# EAGLE design NRF24_4 (EAGLE 6.5.0)
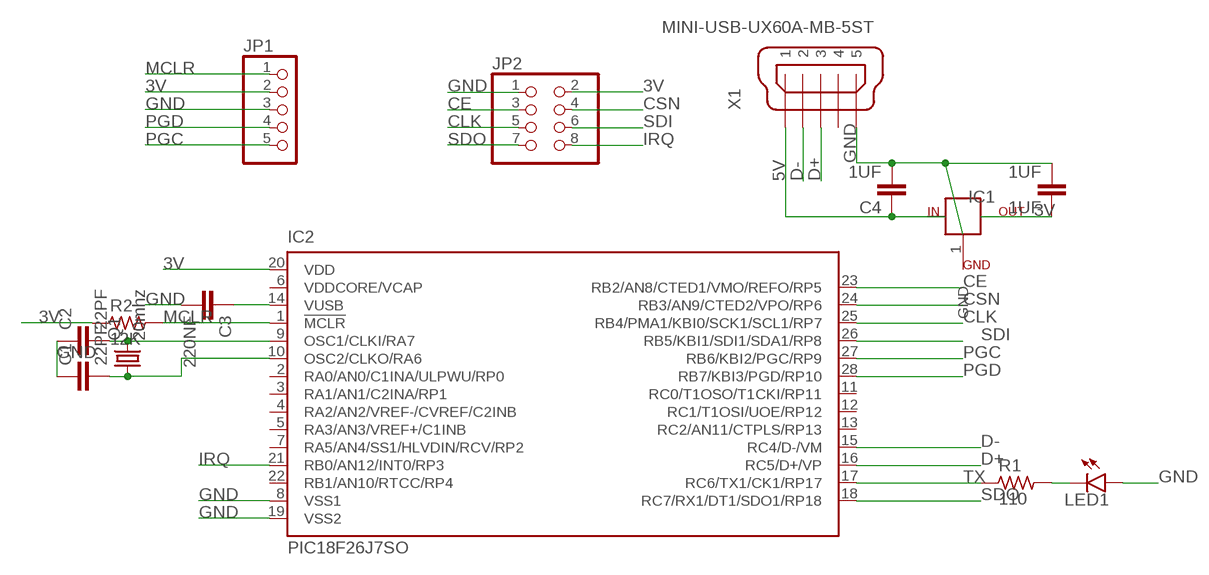
[diagram p0: schematic, sheet 1]

## Parts
1UF  1UF  C-EU025-024X044  [C025-024X044]
C1  22PF  C-EUC0805K  [C0805K]
C2  22PF  C-EUC0805K  [C0805K]
C3  220NF  C-EUC0805K  [C0805K]
C4  1UF  C-EU025-024X044  [C025-024X044]
IC1  MCP17  ZENER-DIODESOT223  [SOT223]
IC2  PIC18F26J7SO  [SO28W]
JP1  PINHD-1X5  [1X05]
JP2  PINHD-2X4  [2X04]
LED1  LED3MM  [LED3MM]
Q1  20mhz  CRYTALHC49S  [HC49/S]
R1  110  R_0805  [R0805]
R2  12K  R_0805  [R0805]
X1  MINI-USB-UX60A-MB-5ST  [UX60A-MB-5ST]

## Nets
3V: 1UF.1 IC1.3(OUT) IC2.20(VDD) JP1.2 JP2.2 R2.1
5V: C4.1 IC1.2(IN) X1.1
CE: IC2.23(RB2/AN8/CTED1/VMO/REFO/RP5) JP2.3
CLK: IC2.25(RB4/PMA1/KBI0/SCK1/SCL1/RP7) JP2.5
CSN: IC2.24(RB3/AN9/CTED2/VPO/RP6) JP2.4
D+: IC2.16(RC5/D+/VP) X1.3
D-: IC2.15(RC4/D-/VM) X1.2
GND: 1UF.2 C1.1 C2.1 C3.2 C4.2 IC1.1(GND) IC2.8(VSS1) IC2.19(VSS2) JP1.3 JP2.1 LED1.A(ANODE) X1.5
IRQ: IC2.21(RB0/AN12/INT0/RP3) JP2.8
MCLR: IC2.1(!MCLR) JP1.1 R2.2
N$4: C1.2 IC2.10(OSC2/CLKO/RA6) Q1.1
N$5: C2.2 IC2.9(OSC1/CLKI/RA7) Q1.2
N$6: C3.1 IC2.14(VUSB)
N$7: LED1.K(CATHODE) R1.2
PGC: IC2.27(RB6/KBI2/PGC/RP9) JP1.5
PGD: IC2.28(RB7/KBI3/PGD/RP10) JP1.4
SDI: IC2.26(RB5/KBI1/SDI1/SDA1/RP8) JP2.6
SDO: IC2.18(RC7/RX1/DT1/SDO1/RP18) JP2.7
TX: IC2.17(RC6/TX1/CK1/RP17) R1.1
Unconnected: IC2.2(RA0/AN0/C1INA/ULPWU/RP0) IC2.3(RA1/AN1/C2INA/RP1) IC2.4(RA2/AN2/VREF-/CVREF/C2INB) IC2.5(RA3/AN3/VREF+/C1INB) IC2.6(VDDCORE/VCAP) IC2.7(RA5/AN4/SS1/HLVDIN/RCV/RP2) IC2.11(RC0/T1OSO/T1CKI/RP11) IC2.12(RC1/T1OSI/UOE/RP12) IC2.13(RC2/AN11/CTPLS/RP13) IC2.22(RB1/AN10/RTCC/RP4) X1.4

## Library data of the parts
1UF C4 = qfm-trx1-24g:C-EU: CAPACITOR, European symbol
C1-C3 = rcl 2:C-EU: CAPACITOR, European symbol
IC1 = diode 2:ZENER-DIODE: Z-Diode
IC2 = microchip-dspic:PIC18F26J*: PIC18F47J53 Family High-Performance USB Microcontrollers with nanoWatt XLP Technology Source: Data sheet <http://ww1.microchip.com/downloads/en/DeviceDoc/39964B.pdf>; MPN: PIC18F27J53-I/SO; OC_FARNELL: unknown; OC_NEWARK: 63R7838
JP1 = pinhead 2:PINHD-1X5: PIN HEADER
JP2 = pinhead 2:PINHD-2X4: PIN HEADER
LED1 = tango:LED: LED OSRAM: - CHIPLED LG R971, LG N971, LY N971, LG Q971, LY Q971, LO R971, LY R971 LH N974, LH R974 LS Q976, LO Q976, LY Q976 LO Q996 - Hyper CHIPLED LW Q18S LB Q993, LB Q99A, LB R99A - SideLED LS A670, LO A670, LY A670, LG A670, LP A670 LB A673, LV A673, LT A673, LW A673 LH A674 LY A675 LS A676, LA A676, LO A676, LY A676, LW A676 LS A679, LY A679, LG A679 - Hyper Micro SIDELED® LS Y876, LA Y876, LO Y876, LY Y876 LT Y87S - SmartLED LW L88C, LW L88S LB L89C, LB L89S, LG L890 LS L89K, LO L89K, LY L89K LS L896, LA L896, LO L896, LY L896 - TOPLED LS T670, LO T670, LY T670, LG T670, LP T670 LSG T670, LSP T670, LSY T670, LOP T670, LYG T670 LG T671, LOG T671, LSG T671 LB T673, LV T673, LT T673, LW T673 LH T674 LS T676, LA T676, LO T676, LY T676, LB T676, LH T676, LSB T676, LW T676 LB T67C, LV T67C, LT T67C, LS T67K, LO T67K, LY T67K, LW E67C LS E67B, LA E67B, LO E67B, LY E67B, LB E67C, LV E67C, LT E67C LW T67C LS T679, LY T679, LG T679 LS T770, LO T770, LY T770, LG T770, LP T770 LB T773, LV T773, LT T773, LW T773 LH T774 LS E675, LA E675, LY E675, LS T675 LS T776, LA T776, LO T776, LY T776, LB T776 LHGB T686 LT T68C, LB T68C - Hyper Mini TOPLED® LB M676 - Mini TOPLED Santana® LG M470 LS M47K, LO M47K, LY M47K Source: http://www.osram.convergy.de - LUMILED® LXK2-PW12-R00, LXK2-PW12-S00, LXK2-PW14-U00, LXK2-PW14-V00 LXK2-PM12-R00, LXK2-PM12-S00, LXK2-PM14-U00 LXK2-PE12-Q00, LXK2-PE12-R00, LXK2-PE12-S00, LXK2-PE14-T00, LXK2-PE14-U00 LXK2-PB12-K00, LXK2-PB12-L00, LXK2-PB12-M00, LXK2-PB14-N00, LXK2-PB14-P00, LXK2-PB14-Q00 LXK2-PR12-L00, LXK2-PR12-M00, LXK2-PR14-Q00, LXK2-PR14-R00 LXK2-PD12-Q00, LXK2-PD12-R00, LXK2-PD12-S00 LXK2-PH12-R00, LXK2-PH12-S00 LXK2-PL12-P00, LXK2-PL12-Q00, LXK2-PL12-R00 Source: www.luxeon.com
Q1 = crystal 2:CRYTAL: CRYSTAL
R1 R2 = rc-master:R_: RESISTOR
X1 = con-hirose 2:MINI-USB-: MINI USB Connector Source: http://www.hirose.co.jp/cataloge_hp/e24000019.pdf

## Board
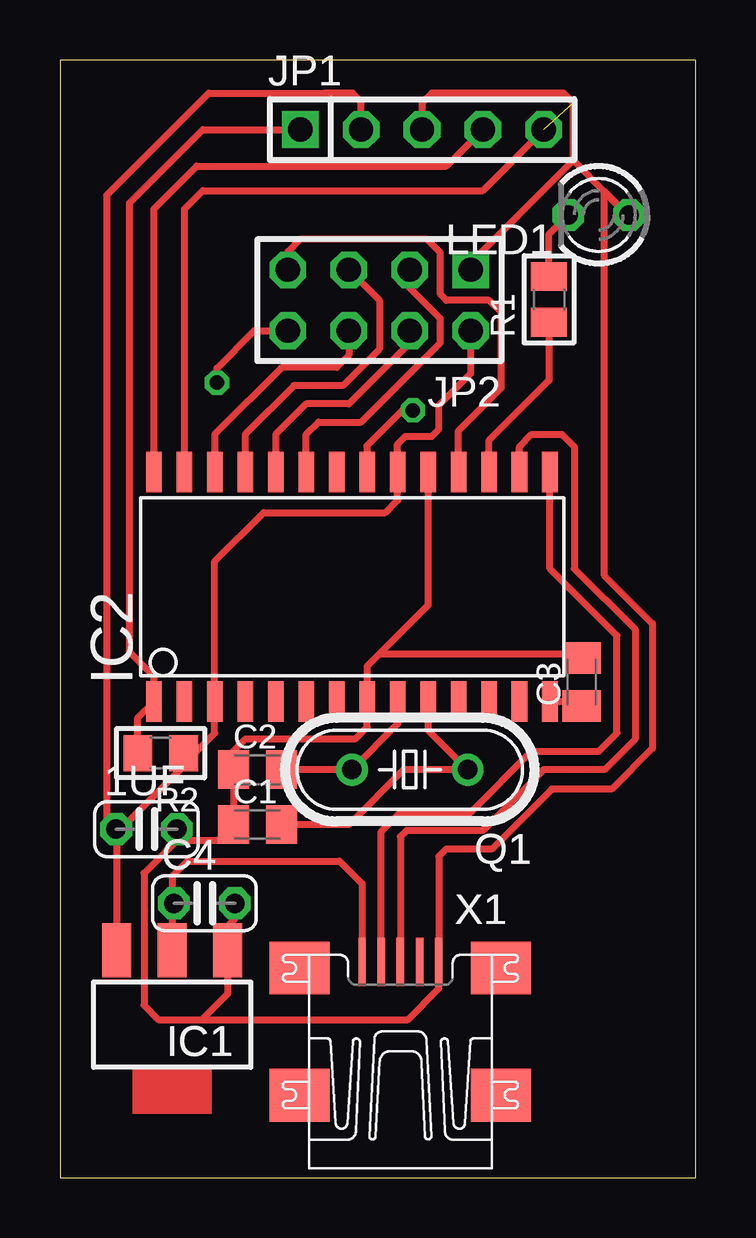
[diagram p1: board, top side]
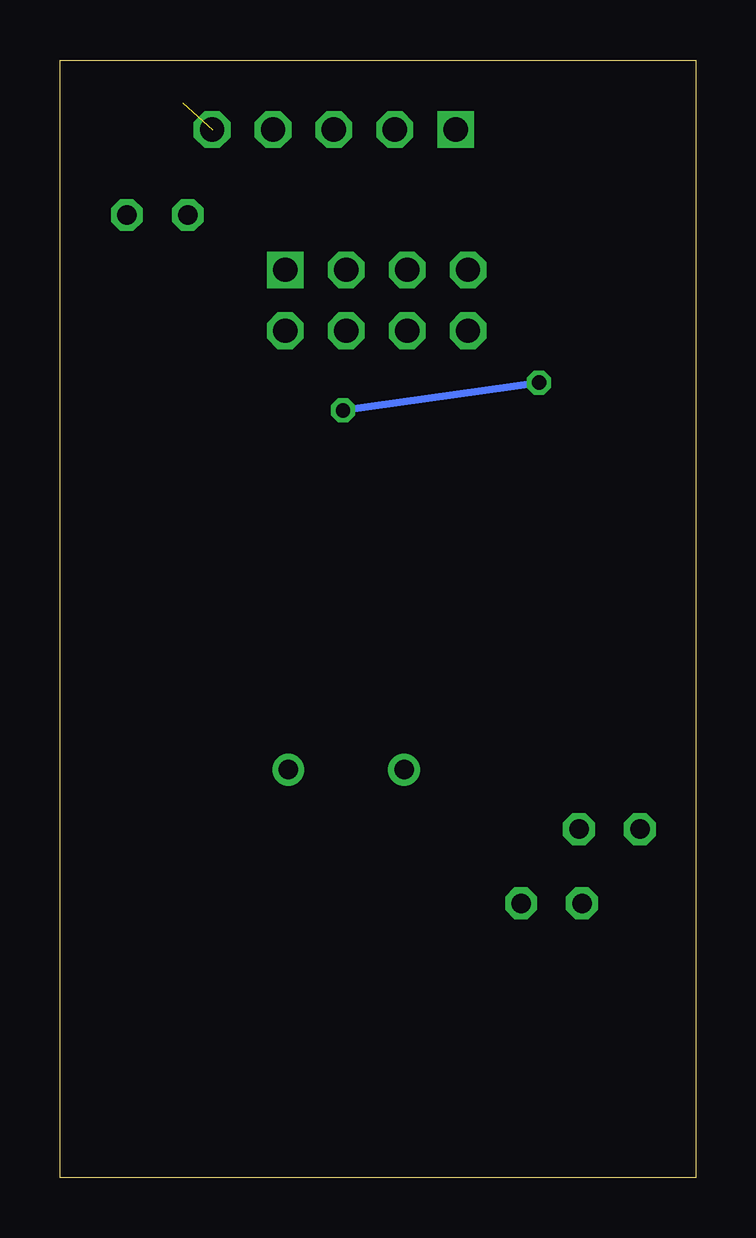
[diagram p2: board, bottom side, seen from below]

Size 26.52 x 46.58 mm. Coordinates in mm from the lower left corner, seen from the top.
Outline: 0,0 26.52,0 26.52,46.58 0,46.58 0,0
Copper layers (1*16): Top 0.035mm / dielectric 1.5mm / Bottom 0.035mm
Design rules "default": minimum track width 10mil, minimum drill 24mil, track to track 8mil, track to pad 8mil, pad to pad 8mil, via to via 8mil, smd to smd 8mil, copper to edge 40mil, drill to drill 8mil, minimum pad ring 10mil, minimum via ring 8mil, stop-mask expansion 4mil, vias tented up to drill 0mil, thermal gap 10mil

### Footprints (pad centres in the part's own frame; a part is rotated, then mirrored left to right if it is on the bottom)
C025-024X044 = drill 0.813 octagon: 1 -1.27,0; 2 1.27,0
C0805K = smd 1.3 x 1.6: 1 -1,0; 2 1,0
SOT223 = smd 1.219 x 2.235: 1 -2.311,-3.099; 2 0,-3.099; 3 2.311,-3.099
SO28W = smd 0.65 x 1.7: 1 -7.62,-4.78; 2 -6.35,-4.78; 3 -5.08,-4.78; 4 -3.81,-4.78; 5 -2.54,-4.78; 6 -1.27,-4.78; 7 0,-4.78; 8 1.27,-4.78; 9 2.54,-4.78; 10 3.81,-4.78; 11 5.08,-4.78; 12 6.35,-4.78; 13 7.62,-4.78; 14 8.89,-4.78; 15 8.89,4.78; 16 7.62,4.78; 17 6.35,4.78; 18 5.08,4.78; 19 3.81,4.78; 20 2.54,4.78; 21 1.27,4.78; 22 0,4.78; 23 -1.27,4.78; 24 -2.54,4.78; 25 -3.81,4.78; 26 -5.08,4.78; 27 -6.35,4.78; 28 -7.62,4.78
1X05 = drill 1.016 square: 1 -5.08,0 | drill 1.016 octagon: 2 -2.54,0; 3 0,0; 4 2.54,0; 5 5.08,0
2X04 = drill 1.016 square: 1 -3.81,-1.27 | drill 1.016 octagon: 2 -3.81,1.27; 3 -1.27,-1.27; 4 -1.27,1.27; 5 1.27,-1.27; 6 1.27,1.27; 7 3.81,-1.27; 8 3.81,1.27
LED3MM = drill 0.813 octagon: A -1.27,0; K 1.27,0
HC49/S = drill 0.813: 1 -2.413,0; 2 2.413,0
R0805 = smd 1.2 x 1.5: 1 -0.953,0; 2 0.953,0
UX60A-MB-5ST = smd 2.032 x 0.305: 1 2.25,1.6; 2 2.25,0.8; 3 2.25,0; 4 2.25,-0.8; 5 2.25,-1.6 | smd 2.2 x 2.5: M1 -3.3,-4.2; M2 -3.3,4.2; M3 2,4.2; M4 2,-4.2

### Placement (x,y rotation side)
1UF  3.61,14.53 0 top
C1  8.24,14.72 0 top
C2  8.24,17.01 0 top
C3  21.75,20.67 90 top
C4  6.02,11.44 0 top
IC1  4.68,6.39 180 top
IC2  11.54,24.63 0 top
JP1  15.09,43.68 0 top
JP2  13.32,36.57 180 top
LED1  22.46,40.12 180 top
Q1  14.59,17.01 180 top
R1  20.39,36.61 90 top
R2  4.2,17.7 180 top
X1  14.19,6.75 90 top

### Tracks (layer width: path | path; a pad name or v marks a point on that pad's centre or on a via)
3V
  Top 0.3: JP2.2 17.13,33.52 15.8,32.19 15.8,31.2 15.5,30.9 14.4,30.9 14.08,30.58 IC2.20 14.08,28.23 13.57,27.72 8.49,27.72 6.46,25.69 6.46,18.53 5.62,17.7 R2.1 5,17.65 5,17 2.58,14.58 2.37,14.58 2.37,14.47 | 2.37,14.47 IC1.3 | 2.37,14.47 1UF.1 1.94,14.93 1.94,40.94 6.2,45.2 11.03,45.2 12.2,45.2 12.55,44.85 JP1.2
5V
  Top 0.3: X1.1 12.59,12.26 11.65,13.2 5.3,13.2 4.68,12.58 4.68,11.8 | 4.68,11.8 IC1.2 | C4.1 4.64,11.44 4.68,11.8
CE
  Top 0.3: JP2.3 14.59,37.08 15.86,35.81 15.86,34.79 12.55,31.49 10.78,31.49 10.27,30.98 IC2.23
CLK
  Top 0.3: JP2.5 13.32,36.57 13.32,34.54 11.79,33.01 9.76,33.01 7.73,30.98 IC2.25
CSN
  Top 0.3: JP2.4 14.59,34.79 12.05,32.25 10.27,32.25 9,30.98 IC2.24
D+
  Top 0.3: IC2.16 19.16,30.47 19.67,30.98 20.94,30.98 21.44,30.47 21.44,25.39 23.98,22.85 23.98,18.28 22.71,17.01 20.17,17.01 17.63,14.47 14.45,14.47 14.19,14.22 X1.3
D-
  Top 0.3: X1.2 13.39,14.43 14.19,15.23 17.13,15.23 19.67,17.77 22.46,17.77 23.22,18.53 23.22,22.6 20.43,25.39 IC2.15
GND  (1 unrouted)
  Top 0.203: JP2.1 17.13,38.13 | 21.4,42.4 21.4,42.39 | JP1.3
  Top 0.3: IC2.19 15.35,23.87 13.32,21.84 | 13.32,21.84 12.81,21.33 IC2.8 12.81,18.79 12.3,18.28 7.73,18.28 6.96,17.51 C2.1 C1.1 6.59,14.08 4.88,14.08 | 13.32,21.84 21.7,21.84 21.95,21.58 | 21.95,21.33 C3.2 21.95,21.58 | 21.95,21.58 21.7,21.58 | 5.9,6.6 4.1,6.6 3.5,7.2 3.5,12.7 4.88,14.08 | C4.2 7.29,10.79 7,10.5 IC1.1 7,9.18 7,7.7 5.9,6.6 | 1UF.2 4.88,14.08 | 5.9,6.6 14.5,6.6 15.8,7.9 15.8,9.74 X1.5 15.8,9.76 15.8,13.4 16.1,13.7 18,13.7 20.5,16.2 23,16.2 24.7,17.9 24.7,23.1 22.7,25.1 22.7,41.09 21.4,42.39 | 23.7,40.1 23.71,40.1 LED1.A | 20.16,43.68 20.14,43.66 | 17.13,38.13 21.4,42.4 21.4,44.8 21,45.2 15.5,45.2 15.1,44.8 JP1.3
  Top 0.305: 23.7,40.1 23.69,40.1 22.7,41.09
IRQ  (via drill 0.6)
  Top 0.3: v14.72,31.98 14.28,31.98 12.8,30.5 IC2.21 | v6.54,33.14 6.54,33.74 8.1,35.3 JP2.8
  Bottom 0.3: v14.72,31.98 14.74,32.03
  Bottom 0.305: v6.54,33.14 v14.72,31.98
MCLR
  Top 0.3: JP1.1 5.95,43.68 2.9,40.63 2.9,21.9 3.9,20.9 3.9,19.87 IC2.1 3.25,19.18 R2.2
N$4
  Top 0.3: IC2.10 15.35,18.66 Q1.1 14.33,17.01 12.05,14.72 C1.2
N$5
  Top 0.3: IC2.9 14.08,18.92 Q1.2 C2.2
N$6
  Top 0.3: 20.47,19.55 IC2.14 21.74,19.83 C3.1
N$7
  Top 0.3: R1.2 20.39,39.32 LED1.K
PGC
  Top 0.3: IC2.27 5.19,40.38 5.95,41.14 17.63,41.14 JP1.5
PGD
  Top 0.3: IC2.28 3.92,40.38 5.7,42.16 11.54,42.16 16.11,42.16 JP1.4
SDI
  Top 0.3: JP2.6 12.05,34.28 11.54,33.77 9.25,33.77 6.46,30.98 IC2.26
SDO
  Top 0.3: IC2.18 16.62,31.14 18.4,32.92 18.4,36.06 17.89,36.57 16.11,36.57 15.86,36.82 15.86,38.55 15.29,39.11 10.01,39.11 9.51,38.6 JP2.7
TX
  Top 0.3: IC2.17 17.89,30.73 20.39,33.23 R1.1

### Text on the board
_tNames: JP1 | JP1 | LED1 | LED1 | R1 | R1 | JP2 | JP2 | IC2 | IC2 | C3 | C3 | C2 | C2 | 1UF | 1UF | R2 | R2 | C1 | C1 | Q1 | Q1 | C4 | C4 | X1 | X1 | IC1 | IC1